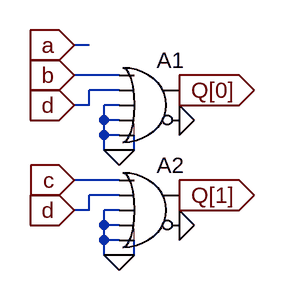
[diagram p0: schematic encoder_2bit.asc]
encoder_2bit.asc, the LTspice schematic file:
Version 4
SHEET 1 880 680
WIRE 80 32 64 32
WIRE 112 64 64 64
WIRE 112 80 80 80
WIRE 80 96 80 80
WIRE 80 96 64 96
WIRE 112 96 96 96
WIRE 96 112 96 96
WIRE 112 112 96 112
WIRE 96 128 96 112
WIRE 112 128 96 128
WIRE 96 144 96 128
WIRE 112 144 96 144
WIRE 128 144 128 128
WIRE 128 144 112 144
WIRE 112 176 64 176
WIRE 112 192 80 192
WIRE 80 208 80 192
WIRE 80 208 64 208
WIRE 112 208 96 208
WIRE 96 224 96 208
WIRE 112 224 96 224
WIRE 96 240 96 224
WIRE 112 240 96 240
WIRE 96 256 96 240
WIRE 112 256 96 256
WIRE 128 256 128 240
WIRE 128 256 112 256
FLAG 112 144 0
FLAG 112 256 0
FLAG 176 224 0
FLAG 176 112 0
FLAG 64 64 b
IOPIN 64 64 In
FLAG 64 176 c
IOPIN 64 176 In
FLAG 64 208 d
IOPIN 64 208 In
FLAG 64 96 d
IOPIN 64 96 In
FLAG 64 32 a
IOPIN 64 32 In
FLAG 176 80 Q[0]
IOPIN 176 80 Out
FLAG 176 192 Q[1]
IOPIN 176 192 Out
SYMBOL Digital\\or 144 32 R0
SYMATTR InstName A1
SYMBOL Digital\\or 144 144 R0
SYMATTR InstName A2

The netlist it stands for:
* encoder_2bit.asc
A1 b d 0 0 0 0 Q[0] 0 OR
A2 c d 0 0 0 0 Q[1] 0 OR
.backanno
.end